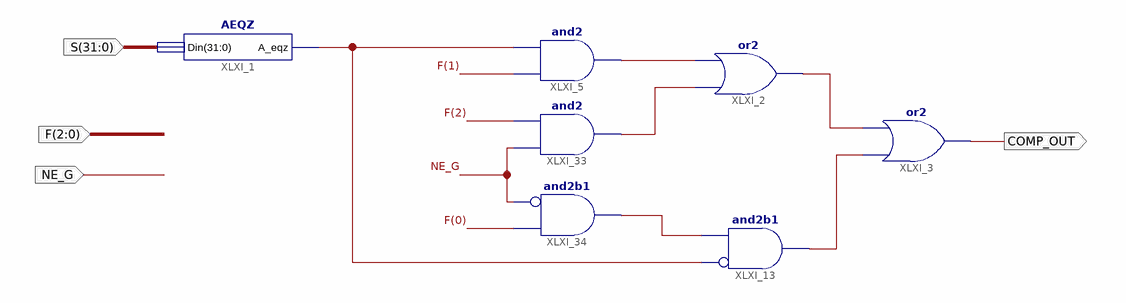
[diagram p0: schematic sheet 1]
// Xilinx ISE schematic ALU_Compare.sch (spartan6) as structural Verilog: 7 symbols, 4 ports
module ALU_Compare (
  input  [31:0] S,
  input  [2:0] F,
  input  NE_G,
  output COMP_OUT
);

  wire XLXN_6, XLXN_8, XLXN_9, XLXN_11, XLXN_12, XLXN_39;

  AEQZ XLXI_1 (.Din(S), .A_eqz(XLXN_11));
  or XLXI_2 (XLXN_9, XLXN_12, XLXN_6);
  or XLXI_3 (COMP_OUT, XLXN_8, XLXN_9);
  and XLXI_13 (XLXN_8, ~XLXN_11, XLXN_39);  // and2b1
  and XLXI_5 (XLXN_6, F[1], XLXN_11);
  and XLXI_33 (XLXN_12, NE_G, F[2]);
  and XLXI_34 (XLXN_39, ~NE_G, F[0]);  // and2b1
endmodule
